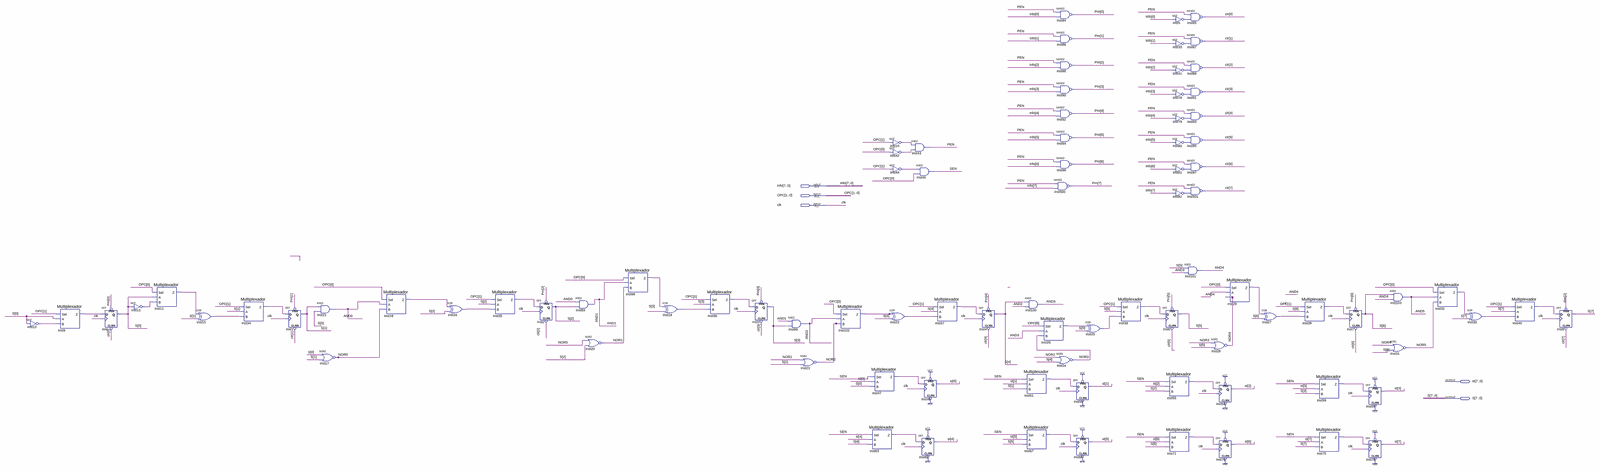
[diagram p0: schematic sheet, whole]
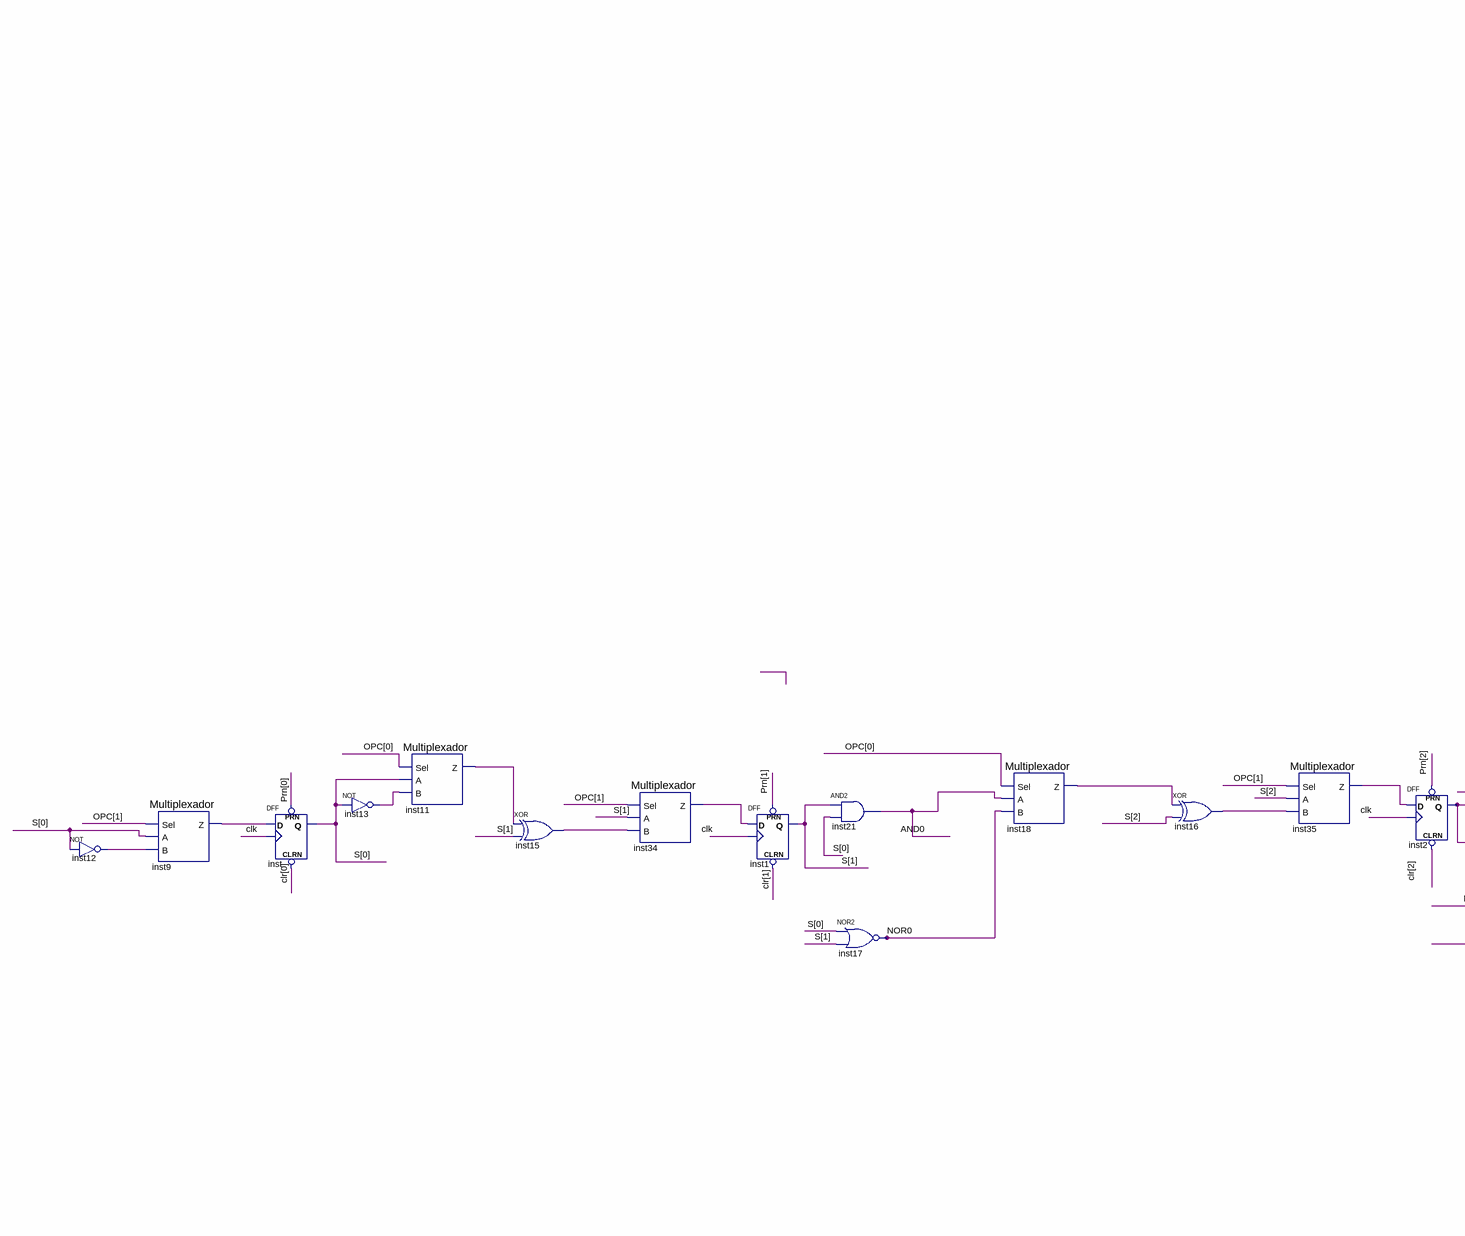
[diagram p1: schematic sheet, left part]
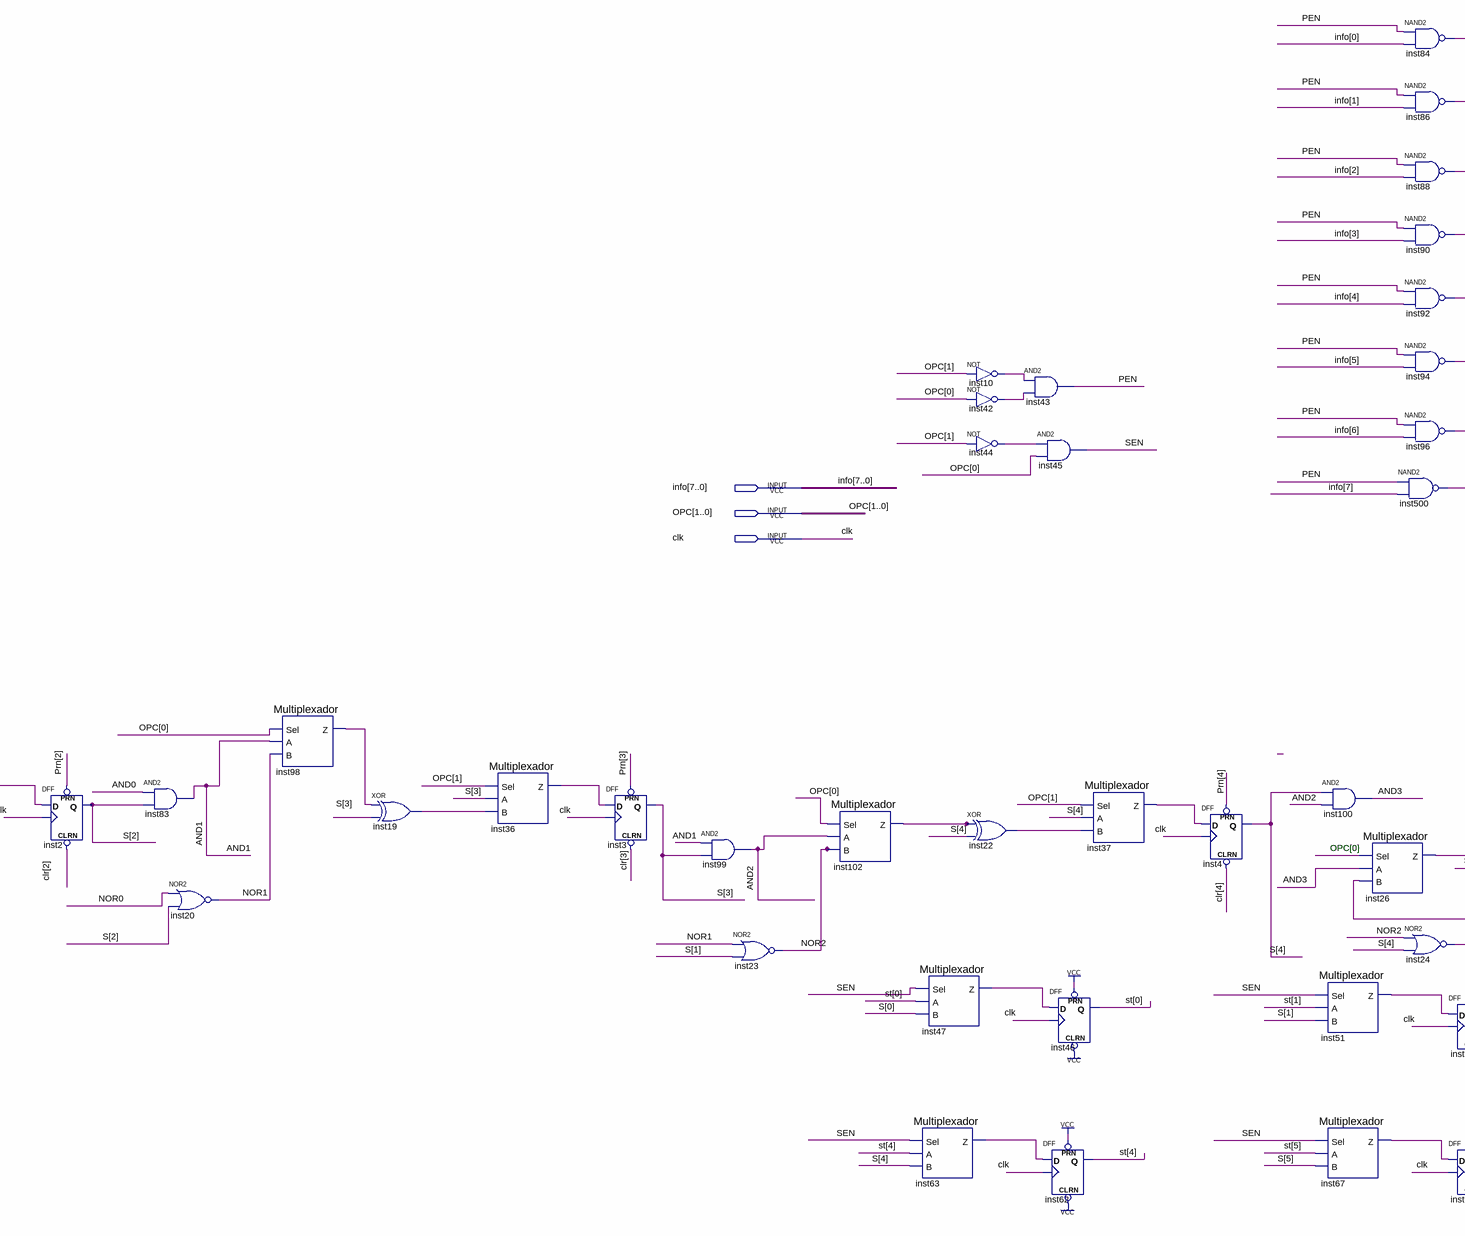
[diagram p2: schematic sheet, centre part]
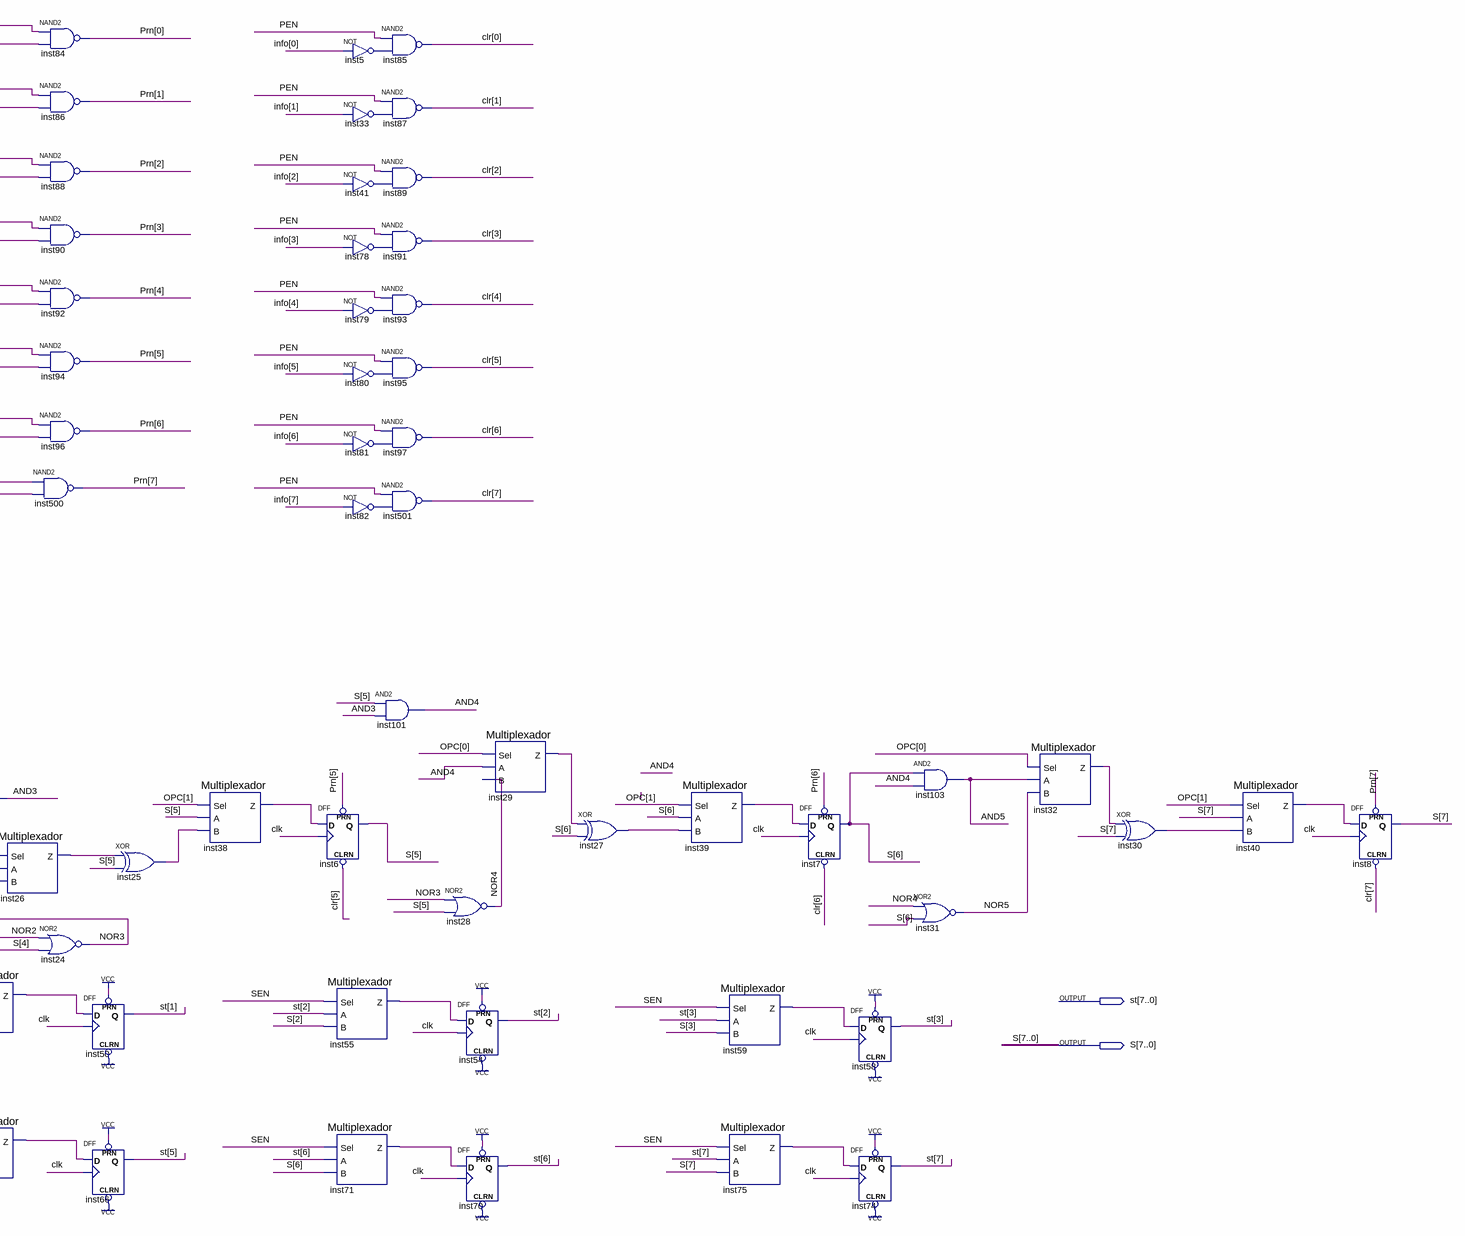
[diagram p3: schematic sheet, right part]
// Quartus schematic PC.bdf as structural Verilog: 89 symbols, 5 pins
module PC (
  input  [7:0] info,
  input  [1:0] OPC,
  input  clk,
  output [7:0] st,
  output [7:0] S
);

  wire AND0, AND1, AND2, AND3, AND4, AND5, inst5_out, inst9_z, inst10_out, inst11_z, inst12_out, inst13_out,
       inst15_out, inst16_out, inst18_z, inst19_out, inst22_out, inst25_out, inst26_z, inst27_out, inst29_z,
       inst30_out, inst32_z, inst33_out, inst34_z, inst35_z, inst36_z, inst37_z, inst38_z, inst39_z,
       inst40_z, inst41_out, inst42_out, inst44_out, inst47_z, inst51_z, inst55_z, inst59_z, inst63_z,
       inst67_z, inst71_z, inst75_z, inst78_out, inst79_out, inst80_out, inst81_out, inst82_out, inst98_z,
       inst102_z, NOR0, NOR1, NOR2, NOR3, NOR4, NOR5, PEN, SEN;
  wire [7:0] clr, Prn;

  not inst12 (inst12_out, S[0]);
  Multiplexador inst9 (.Sel(OPC[1]), .A(S[0]), .B(inst12_out), .Z(inst9_z));
  DFF inst (.CLRN(clr[0]), .CLK(clk), .D(inst9_z), .PRN(Prn[0]), .Q(S[0]));
  not inst13 (inst13_out, S[0]);
  Multiplexador inst11 (.Sel(OPC[0]), .A(S[0]), .B(inst13_out), .Z(inst11_z));
  xor inst15 (inst15_out, inst11_z, S[1]);
  Multiplexador inst34 (.Sel(OPC[1]), .A(S[1]), .B(inst15_out), .Z(inst34_z));
  DFF inst1 (.CLRN(clr[1]), .CLK(clk), .D(inst34_z), .PRN(Prn[1]), .Q(S[1]));
  and inst21 (AND0, S[1], S[0]);
  nor inst17 (NOR0, S[0], S[1]);
  Multiplexador inst18 (.Sel(OPC[0]), .A(AND0), .B(NOR0), .Z(inst18_z));
  xor inst16 (inst16_out, inst18_z, S[2]);
  Multiplexador inst35 (.Sel(OPC[1]), .A(S[2]), .B(inst16_out), .Z(inst35_z));
  DFF inst2 (.CLRN(clr[2]), .CLK(clk), .D(inst35_z), .PRN(Prn[2]), .Q(S[2]));
  and inst83 (AND1, AND0, S[2]);
  nor inst20 (NOR1, NOR0, S[2]);
  Multiplexador inst98 (.Sel(OPC[0]), .A(AND1), .B(NOR1), .Z(inst98_z));
  xor inst19 (inst19_out, inst98_z, S[3]);
  Multiplexador inst36 (.Sel(OPC[1]), .A(S[3]), .B(inst19_out), .Z(inst36_z));
  DFF inst3 (.CLRN(clr[3]), .CLK(clk), .D(inst36_z), .PRN(Prn[3]), .Q(S[3]));
  and inst99 (AND2, AND1, S[3]);
  nor inst23 (NOR2, NOR1, S[1]);
  Multiplexador inst102 (.Sel(OPC[0]), .A(AND2), .B(NOR2), .Z(inst102_z));
  Multiplexador inst47 (.Sel(SEN), .A(st[0]), .B(S[0]), .Z(inst47_z));
  Multiplexador inst63 (.Sel(SEN), .A(st[4]), .B(S[4]), .Z(inst63_z));
  not inst10 (inst10_out, OPC[1]);
  not inst42 (inst42_out, OPC[0]);
  not inst44 (inst44_out, OPC[1]);
  xor inst22 (inst22_out, inst102_z, S[4]);
  and inst43 (PEN, inst10_out, inst42_out);
  and inst45 (SEN, inst44_out, OPC[0]);
  DFF inst46 (.CLRN(1'b1), .CLK(clk), .D(inst47_z), .PRN(1'b1), .Q(st[0]));
  DFF inst62 (.CLRN(1'b1), .CLK(clk), .D(inst63_z), .PRN(1'b1), .Q(st[4]));
  Multiplexador inst37 (.Sel(OPC[1]), .A(S[4]), .B(inst22_out), .Z(inst37_z));
  DFF inst4 (.CLRN(clr[4]), .CLK(clk), .D(inst37_z), .PRN(Prn[4]), .Q(S[4]));
  and inst100 (AND3, S[4], AND2);
  Multiplexador inst51 (.Sel(SEN), .A(st[1]), .B(S[1]), .Z(inst51_z));
  Multiplexador inst67 (.Sel(SEN), .A(st[5]), .B(S[5]), .Z(inst67_z));
  Multiplexador inst26 (.Sel(OPC[0]), .A(AND3), .B(NOR3), .Z(inst26_z));
  nand inst84 (Prn[0], PEN, info[0]);
  nand inst86 (Prn[1], PEN, info[1]);
  nand inst88 (Prn[2], PEN, info[2]);
  nand inst90 (Prn[3], PEN, info[3]);
  nand inst92 (Prn[4], PEN, info[4]);
  nand inst94 (Prn[5], PEN, info[5]);
  nand inst96 (Prn[6], PEN, info[6]);
  nand inst500 (Prn[7], PEN, info[7]);
  nor inst24 (NOR3, NOR2, S[4]);
  DFF inst50 (.CLRN(1'b1), .CLK(clk), .D(inst51_z), .PRN(1'b1), .Q(st[1]));
  DFF inst66 (.CLRN(1'b1), .CLK(clk), .D(inst67_z), .PRN(1'b1), .Q(st[5]));
  xor inst25 (inst25_out, inst26_z, S[5]);
  Multiplexador inst38 (.Sel(OPC[1]), .A(S[5]), .B(inst25_out), .Z(inst38_z));
  not inst5 (inst5_out, info[0]);
  not inst33 (inst33_out, info[1]);
  not inst41 (inst41_out, info[2]);
  not inst78 (inst78_out, info[3]);
  not inst79 (inst79_out, info[4]);
  not inst80 (inst80_out, info[5]);
  not inst81 (inst81_out, info[6]);
  not inst82 (inst82_out, info[7]);
  DFF inst6 (.CLRN(clr[5]), .CLK(clk), .D(inst38_z), .PRN(Prn[5]), .Q(S[5]));
  Multiplexador inst55 (.Sel(SEN), .A(st[2]), .B(S[2]), .Z(inst55_z));
  Multiplexador inst71 (.Sel(SEN), .A(st[6]), .B(S[6]), .Z(inst71_z));
  nand inst85 (clr[0], PEN, inst5_out);
  nand inst87 (clr[1], PEN, inst33_out);
  nand inst89 (clr[2], PEN, inst41_out);
  nand inst91 (clr[3], PEN, inst78_out);
  nand inst93 (clr[4], PEN, inst79_out);
  nand inst95 (clr[5], PEN, inst80_out);
  nand inst97 (clr[6], PEN, inst81_out);
  nand inst501 (clr[7], PEN, inst82_out);
  and inst101 (AND4, S[5], AND3);
  nor inst28 (NOR4, NOR3, S[5]);
  DFF inst54 (.CLRN(1'b1), .CLK(clk), .D(inst55_z), .PRN(1'b1), .Q(st[2]));
  DFF inst70 (.CLRN(1'b1), .CLK(clk), .D(inst71_z), .PRN(1'b1), .Q(st[6]));
  Multiplexador inst29 (.Sel(OPC[0]), .A(AND4), .B(NOR4), .Z(inst29_z));
  xor inst27 (inst27_out, inst29_z, S[6]);
  Multiplexador inst39 (.Sel(OPC[1]), .A(S[6]), .B(inst27_out), .Z(inst39_z));
  Multiplexador inst59 (.Sel(SEN), .A(st[3]), .B(S[3]), .Z(inst59_z));
  Multiplexador inst75 (.Sel(SEN), .A(st[7]), .B(S[7]), .Z(inst75_z));
  DFF inst7 (.CLRN(clr[6]), .CLK(clk), .D(inst39_z), .PRN(Prn[6]), .Q(S[6]));
  DFF inst58 (.CLRN(1'b1), .CLK(clk), .D(inst59_z), .PRN(1'b1), .Q(st[3]));
  DFF inst74 (.CLRN(1'b1), .CLK(clk), .D(inst75_z), .PRN(1'b1), .Q(st[7]));
  and inst103 (AND5, S[6], AND4);
  nor inst31 (NOR5, NOR4, S[6]);
  Multiplexador inst32 (.Sel(OPC[0]), .A(AND5), .B(NOR5), .Z(inst32_z));
  xor inst30 (inst30_out, inst32_z, S[7]);
  Multiplexador inst40 (.Sel(OPC[1]), .A(S[7]), .B(inst30_out), .Z(inst40_z));
  DFF inst8 (.CLRN(clr[7]), .CLK(clk), .D(inst40_z), .PRN(Prn[7]), .Q(S[7]));

  // Notes on the sheet:
  //   OPC[0]
endmodule
